# Altium schematic sheet 3-AUDIO-AMP.SchDoc
size A4
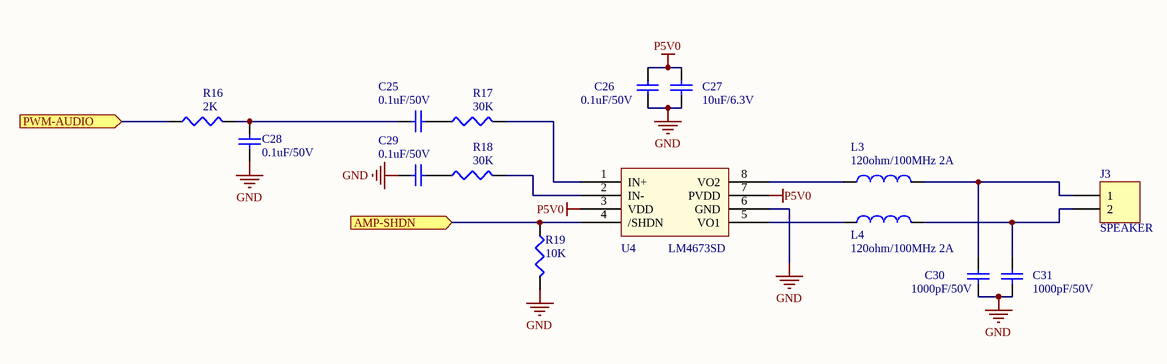
[diagram p0: 3-AUDIO-AMP.SchDoc]

## Parts
C25  0.1uF/50V  [0402]
C26  0.1uF/50V  [0402]
C27  10uF/6.3V  [0603]
C28  0.1uF/50V  [0402]
C29  0.1uF/50V  [0402]
C30  1000pF/50V  [0402]
C31  1000pF/50V  [0402]
J3  SPEAKER  [1250WV-S-2P]
L3  120ohm/100MHz 2A  [0603]
L4  120ohm/100MHz 2A  [0603]
R16  2K  [0402]
R17  30K  [0402]
R18  30K  [0402]
R19  10K  [0402]
U4  LM4673SD  [WSON8]

## Ports
AMP-SHDN (in), PWM-AUDIO (in)

## Nets
GND: C26.1 C27.1 C28.2 C29.2 C30.1 C31.1 R19.2 U4.6(GND)
P5V0: C26.2 C27.2 U4.3(VDD) U4.7(PVDD)
AMP-SHDN: R19.1 U4.4(/SHDN) ; port AMP-SHDN
PWM-AUDIO: R16.1 ; port PWM-AUDIO
NetC25_1: C25.1 R17.1
NetC25_2: C25.2 C28.1 R16.2
NetC29_1: C29.1 R18.1
NetC30_2: C30.2 J3.1 L3.2
NetC31_2: C31.2 J3.2 L4.2
NetL3_1: L3.1 U4.8(VO2)
NetL4_1: L4.1 U4.5(VO1)
NetR17_2: R17.2 U4.1(IN+)
NetR18_2: R18.2 U4.2(IN-)

## Library data of the parts
C25-C31 = Cap: Capacitor; Value: 0.1uF; Published: 8-Jun-2000; LatestRevisionDate: 17-Jul-2002; LatestRevisionNote: Re-released for DXP Platform.; PackageReference: RAD-0.3; Publisher: Altium Limited; PackageDescription: Radial Cap, Thru-Hole; 2 Leads; 0.3 in Pin Spacing
J3 = Header 2: Header, 2-Pin; LatestRevisionDate: 17-Jul-2002; LatestRevisionNote: Re-released for DXP Platform.; Publisher: Altium Limited
L3 L4 = Inductor: Code_IEC: 1005; Value: 300ohm/100MHz BEAD; Published: 8-Jun-2000; LatestRevisionDate: 29-May-2009; LatestRevisionNote: IPC-7351 Footprint Added.; PackageReference: 0402-A; Publisher: Altium Limited; PackageDescription: Chip Inductor; Code_JEITA: 0402
R16-R19 = Res3: Resistor; Value: 1K; Published: 8-Jun-2000; LatestRevisionDate: 29-May-2009; LatestRevisionNote: IPC-7351 Footprint Added.; PackageReference: J1-0603; Publisher: Altium Limited; PackageDescription: Chip Resistor